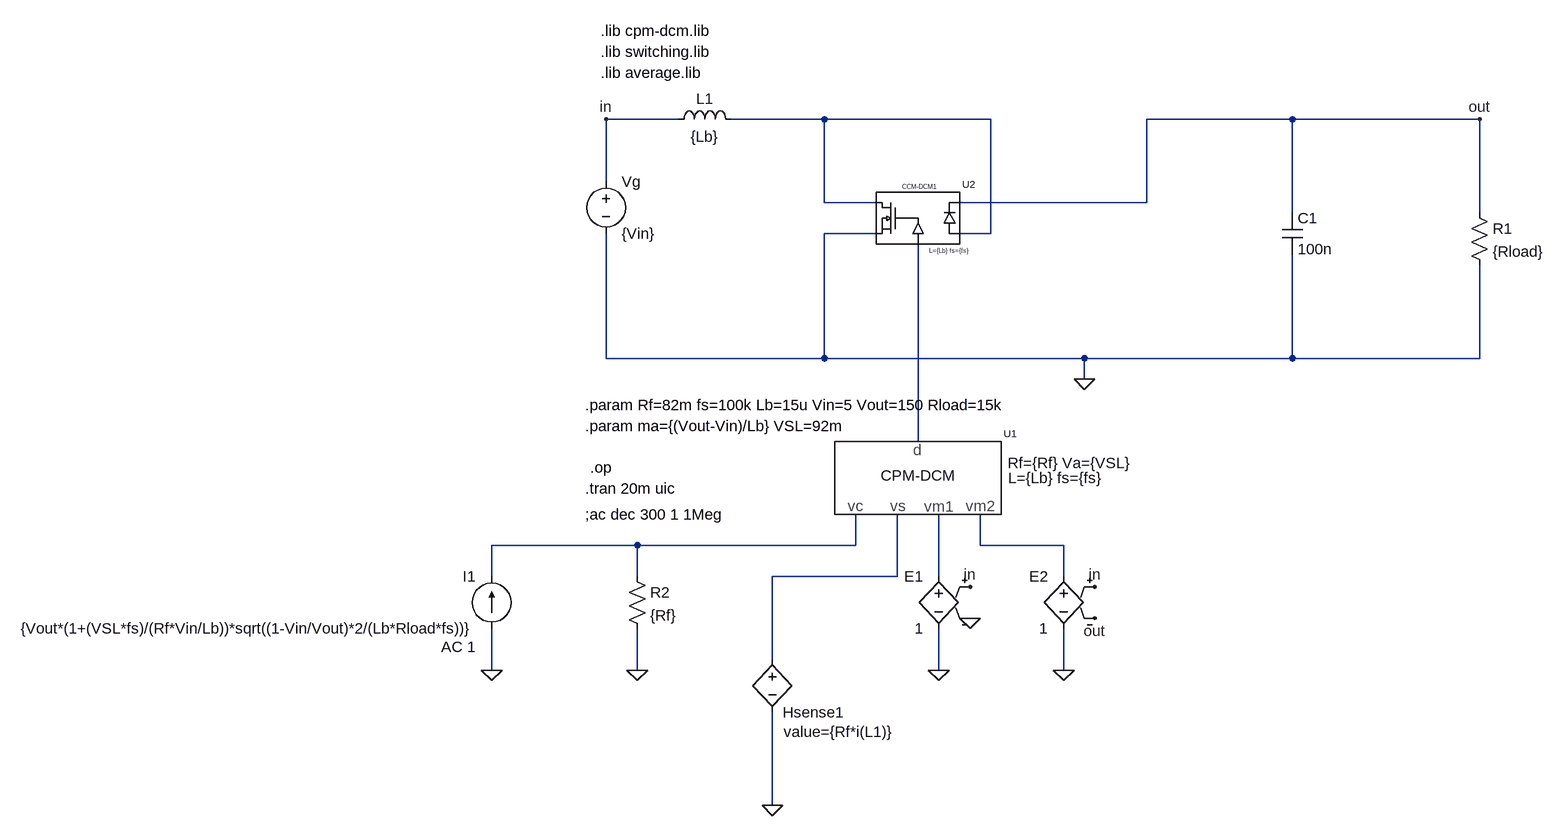
[diagram p0: schematic DCM CPM average.asc]
DCM CPM average.asc, the LTspice schematic file:
Version 4
SHEET 1 1356 1236
WIRE 16 160 -96 160
WIRE 240 160 96 160
WIRE 496 160 240 160
WIRE 960 160 736 160
WIRE 1248 160 960 160
WIRE -96 256 -96 160
WIRE 240 288 240 160
WIRE 320 288 240 288
WIRE 736 288 736 160
WIRE 736 288 448 288
WIRE 960 304 960 160
WIRE 1248 304 1248 160
WIRE 320 336 240 336
WIRE 496 336 496 160
WIRE 496 336 448 336
WIRE -96 528 -96 336
WIRE 240 528 240 336
WIRE 240 528 -96 528
WIRE 640 528 240 528
WIRE 960 528 960 368
WIRE 960 528 640 528
WIRE 1248 528 1248 384
WIRE 1248 528 960 528
WIRE 640 560 640 528
WIRE 384 656 384 352
WIRE -48 816 -272 816
WIRE 288 816 288 768
WIRE 288 816 -48 816
WIRE 480 816 480 768
WIRE 608 816 480 816
WIRE -272 864 -272 816
WIRE -48 864 -48 816
WIRE 352 864 352 768
WIRE 352 864 160 864
WIRE 416 864 416 768
WIRE 608 864 608 816
WIRE 160 992 160 864
WIRE -272 1008 -272 944
WIRE -48 1008 -48 944
WIRE 416 1008 416 944
WIRE 608 1008 608 944
WIRE 160 1216 160 1072
FLAG 640 560 0
FLAG 416 1008 0
FLAG -96 160 in
FLAG 1248 160 out
FLAG 464 880 in
FLAG 464 928 0
FLAG 608 1008 0
FLAG -272 1008 0
FLAG 160 1216 0
FLAG 656 880 in
FLAG 656 928 out
FLAG -48 1008 0
SYMBOL voltage -96 240 R0
WINDOW 123 0 0 Left 0
WINDOW 39 0 0 Left 0
SYMATTR InstName Vg
SYMATTR Value {Vin}
SYMBOL cap 944 304 R0
SYMATTR InstName C1
SYMATTR Value 100n
SYMBOL res 1232 288 R0
SYMATTR InstName R1
SYMATTR Value {Rload}
SYMBOL ccm-dcm1 384 320 R0
SYMATTR SpiceLine L={Lb} fs={fs}
SYMATTR InstName U2
SYMBOL ind 0 176 R270
WINDOW 0 32 56 VTop 2
WINDOW 3 5 56 VBottom 2
SYMATTR InstName L1
SYMATTR Value {Lb}
SYMATTR SpiceLine Rser=90m
SYMBOL cpm 368 704 R0
SYMATTR SpiceLine Rf={Rf} Va={VSL}
SYMATTR SpiceLine2 L={Lb} fs={fs}
SYMATTR InstName U1
SYMATTR Value CPM-DCM
SYMBOL e 416 848 M0
SYMATTR InstName E1
SYMATTR Value 1
SYMBOL e 608 848 M0
SYMATTR InstName E2
SYMATTR Value 1
SYMBOL h 160 976 R0
WINDOW 3 17 127 Left 2
WINDOW 0 16 97 Left 2
SYMATTR Value value={Rf*i(L1)}
SYMATTR InstName Hsense1
SYMBOL current -272 944 R180
WINDOW 0 24 80 Left 2
WINDOW 3 24 0 Left 2
WINDOW 123 24 -28 Left 2
WINDOW 39 0 0 Left 0
SYMATTR InstName I1
SYMATTR Value {Vout*(1+(VSL*fs)/(Rf*Vin/Lb))*sqrt((1-Vin/Vout)*2/(Lb*Rload*fs))}
SYMATTR Value2 AC 1
SYMBOL res -64 848 R0
SYMATTR InstName R2
SYMATTR Value {Rf}
TEXT -104 56 Left 2 !.lib switching.lib
TEXT -104 88 Left 2 !.lib average.lib
TEXT -128 728 Left 2 !.tran 20m uic
TEXT -128 768 Left 2 !;ac dec 300 1 1Meg
TEXT -128 600 Left 2 !.param Rf=82m fs=100k Lb=15u Vin=5 Vout=150 Rload=15k
TEXT -128 632 Left 2 !.param ma={(Vout-Vin)/Lb} VSL=92m
TEXT -120 696 Left 2 !.op
TEXT -104 24 Left 2 !.lib cpm-dcm.lib

The netlist it stands for:
* DCM CPM average.asc
Vg in 0 {Vin}
C1 out 0 100n
R1 out 0 {Rload}
XU2 N001 0 out N001 N002 CCM-DCM1 L={Lb} fs={fs}  ; pins 1 2 3 4 5
L1 in N001 {Lb} Rser=90m
XU1 N003 N005 N006 N004 N002 CPM-DCM Rf={Rf} Va={VSL} L={Lb} fs={fs}  ; pins control current 1 2 d
E1 N006 0 in 0 1
E2 N004 0 in out 1
Hsense1 N005 0 value={Rf*i(L1)}
I1 0 N003 {Vout*(1+(VSL*fs)/(Rf*Vin/Lb))*sqrt((1-Vin/Vout)*2/(Lb*Rload*fs))} AC 1
R2 N003 0 {Rf}
.lib switching.lib
.lib average.lib
.tran 20m uic
;ac dec 300 1 1Meg
.param Rf=82m fs=100k Lb=15u Vin=5 Vout=150 Rload=15k
.param ma={(Vout-Vin)/Lb} VSL=92m
.op
.lib cpm-dcm.lib
.backanno
.end